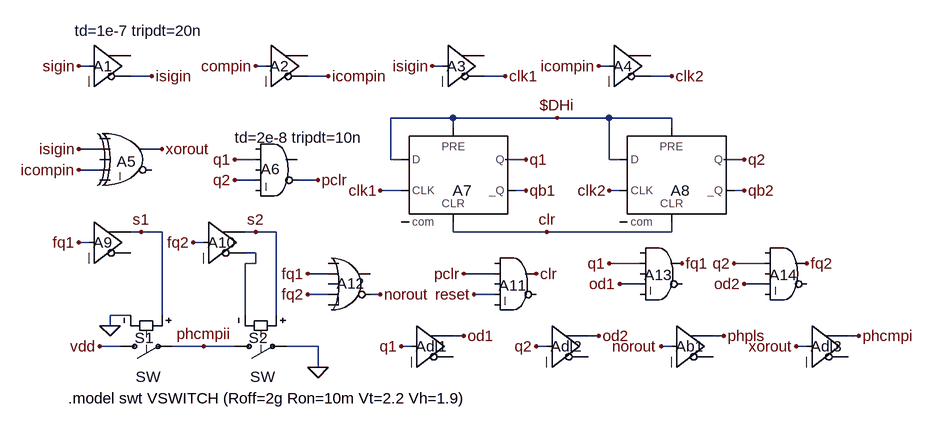
[diagram p0: schematic PspDf.asc]
PspDf.asc, the LTspice schematic file:
Version 4
SHEET 1 1096 720
WIRE -192 192 -208 192
WIRE 80 192 64 192
WIRE 352 192 336 192
WIRE 608 192 592 192
WIRE -96 208 -128 208
WIRE 176 208 144 208
WIRE 448 208 416 208
WIRE 704 208 672 208
WIRE 368 272 272 272
WIRE 528 272 368 272
WIRE 608 272 528 272
WIRE 704 272 608 272
WIRE 368 288 368 272
WIRE 704 288 704 272
WIRE -176 320 -208 320
WIRE -80 320 -112 320
WIRE 64 336 32 336
WIRE 272 336 272 272
WIRE 288 336 272 336
WIRE 480 336 448 336
WIRE 608 336 608 272
WIRE 624 336 608 336
WIRE 816 336 784 336
WIRE -176 352 -208 352
WIRE 64 368 32 368
WIRE 160 368 128 368
WIRE 288 384 256 384
WIRE 480 384 464 384
WIRE 624 384 608 384
WIRE 816 384 800 384
WIRE -112 448 -128 448
WIRE -80 448 -112 448
WIRE 64 448 48 448
WIRE 96 448 64 448
WIRE 368 448 368 432
WIRE 512 448 368 448
WIRE 704 448 704 432
WIRE 704 448 512 448
WIRE -192 464 -208 464
WIRE -16 464 -32 464
WIRE 64 480 48 480
WIRE 64 496 64 480
WIRE 64 496 48 496
WIRE 656 496 608 496
WIRE 848 496 800 496
WIRE 176 512 144 512
WIRE 432 512 384 512
WIRE 656 528 624 528
WIRE 848 528 816 528
WIRE 176 544 144 544
WIRE 256 544 240 544
WIRE 432 544 400 544
WIRE -128 576 -160 576
WIRE -80 576 -80 448
WIRE 48 576 48 496
WIRE 96 576 96 448
WIRE -160 592 -160 576
WIRE 384 608 368 608
WIRE 592 608 576 608
WIRE 784 608 768 608
WIRE 992 608 976 608
WIRE -144 624 -176 624
WIRE -16 624 -64 624
WIRE 32 624 -16 624
WIRE 160 624 112 624
WIRE 304 624 288 624
WIRE 512 624 496 624
WIRE 704 624 688 624
WIRE 912 624 896 624
WIRE 160 656 160 624
FLAG -208 192 sigin
FLAG 64 192 compin
FLAG 336 192 isigin
FLAG 592 192 icompin
FLAG 448 208 clk1
FLAG 704 208 clk2
FLAG -96 208 isigin
FLAG 176 208 icompin
FLAG -80 320 xorout
FLAG -208 320 isigin
FLAG -208 352 icompin
FLAG 32 336 q1
FLAG 32 368 q2
FLAG 160 368 pclr
FLAG 480 384 qb1
FLAG 480 336 q1
FLAG 512 448 clr
FLAG 256 384 clk1
FLAG 608 384 clk2
FLAG 528 272 $DHi
FLAG 816 336 q2
FLAG 816 384 qb2
FLAG -208 464 fq1
FLAG -160 592 0
FLAG -112 448 s1
FLAG -32 464 fq2
FLAG 64 448 s2
FLAG -176 624 vdd
FLAG -16 624 phcmpii
FLAG 160 656 0
FLAG 384 512 pclr
FLAG 400 544 reset
FLAG 496 512 clr
FLAG 256 544 norout
FLAG 144 512 fq1
FLAG 144 544 fq2
FLAG 608 496 q1
FLAG 624 528 od1
FLAG 720 496 fq1
FLAG 800 496 q2
FLAG 816 528 od2
FLAG 912 496 fq2
FLAG 288 624 q1
FLAG 384 608 od1
FLAG 496 624 q2
FLAG 592 608 od2
FLAG 688 624 norout
FLAG 784 608 phpls
FLAG 992 608 phcmpi
FLAG 896 624 xorout
SYMBOL Digital\\buf -192 128 R0
WINDOW 0 6 64 Left 0
WINDOW 3 -22 10 Left 0
SYMATTR InstName A1
SYMATTR Value td=1e-7 tripdt=20n
SYMBOL Digital\\buf 80 128 R0
WINDOW 0 6 64 Left 0
SYMATTR InstName A2
SYMBOL Digital\\buf 352 128 R0
WINDOW 0 6 64 Left 0
SYMATTR InstName A3
SYMBOL Digital\\buf 608 128 R0
WINDOW 0 6 64 Left 0
SYMATTR InstName A4
SYMBOL Digital\\xor -128 272 R0
WINDOW 0 -22 67 Left 0
SYMATTR InstName A5
SYMBOL Digital\\and 96 288 R0
WINDOW 0 -24 63 Left 0
WINDOW 3 -64 14 Left 0
SYMATTR InstName A6
SYMATTR Value td=2e-8 tripdt=10n
SYMBOL Digital\\dflop 368 288 R0
WINDOW 0 -1 96 Left 0
SYMATTR InstName A7
SYMBOL Digital\\dflop 704 288 R0
WINDOW 0 -1 96 Left 0
SYMATTR InstName A8
SYMBOL Digital\\buf -192 400 R0
WINDOW 0 6 64 Left 0
SYMATTR InstName A9
SYMBOL Digital\\buf -16 400 R0
WINDOW 0 6 64 Left 0
SYMATTR InstName A10
SYMBOL sw -160 624 M90
WINDOW 0 -13 67 VLeft 0
WINDOW 3 47 78 VLeft 0
SYMATTR InstName S1
SYMBOL sw 16 624 M90
WINDOW 0 -13 67 VLeft 0
WINDOW 3 47 78 VLeft 0
SYMATTR InstName S2
SYMBOL Digital\\and 464 464 R0
WINDOW 0 -26 66 Left 0
SYMATTR InstName A11
SYMBOL Digital\\or 208 464 R0
WINDOW 0 -19 63 Left 0
SYMATTR InstName A12
SYMBOL Digital\\and 688 448 R0
WINDOW 0 -26 66 Left 0
SYMATTR InstName A13
SYMBOL Digital\\and 880 448 R0
WINDOW 0 -26 66 Left 0
SYMATTR InstName A14
SYMBOL Digital\\buf 304 560 R0
WINDOW 0 6 64 Left 0
SYMATTR InstName Adl1
SYMBOL Digital\\buf 512 560 R0
WINDOW 0 6 64 Left 0
SYMATTR InstName Adl2
SYMBOL Digital\\buf 704 560 R0
WINDOW 0 6 64 Left 0
SYMATTR InstName Ab1
SYMBOL Digital\\buf 912 560 R0
WINDOW 0 6 64 Left 0
SYMATTR InstName Adl3
TEXT -224 704 Left 0 !.model swt VSWITCH (Roff=2g Ron=10m Vt=2.2 Vh=1.9)

The netlist it stands for:
* PspDf.asc
A1 sigin 0 0 0 0 isigin 0 0 BUF td=1e-7 tripdt=20n
A2 compin 0 0 0 0 icompin 0 0 BUF
A3 isigin 0 0 0 0 clk1 0 0 BUF
A4 icompin 0 0 0 0 clk2 0 0 BUF
A5 0 isigin 0 icompin 0 0 xorout 0 XOR
A6 0 q1 0 q2 0 pclr 0 0 AND td=2e-8 tripdt=10n
A7 $DHi 0 clk1 $DHi clr qb1 q1 0 DFLOP
A8 $DHi 0 clk2 $DHi clr qb2 q2 0 DFLOP
A9 fq1 0 0 0 0 0 s1 0 BUF
A10 fq2 0 0 0 0 N001 s2 0 BUF
S1 vdd phcmpii s1 0 SW
S2 phcmpii 0 s2 N001 SW
A11 0 pclr 0 reset 0 0 clr 0 AND
A12 0 fq1 0 fq2 0 norout 0 0 OR
A13 0 q1 0 od1 0 0 fq1 0 AND
A14 0 q2 0 od2 0 0 fq2 0 AND
Adl1 q1 0 0 0 0 0 od1 0 BUF
Adl2 q2 0 0 0 0 0 od2 0 BUF
Ab1 norout 0 0 0 0 0 phpls 0 BUF
Adl3 xorout 0 0 0 0 0 phcmpi 0 BUF
.model swt VSWITCH (Roff=2g Ron=10m Vt=2.2 Vh=1.9)
.backanno
.end